# Altium schematic sheet Door_Actuator.SchDoc
size A
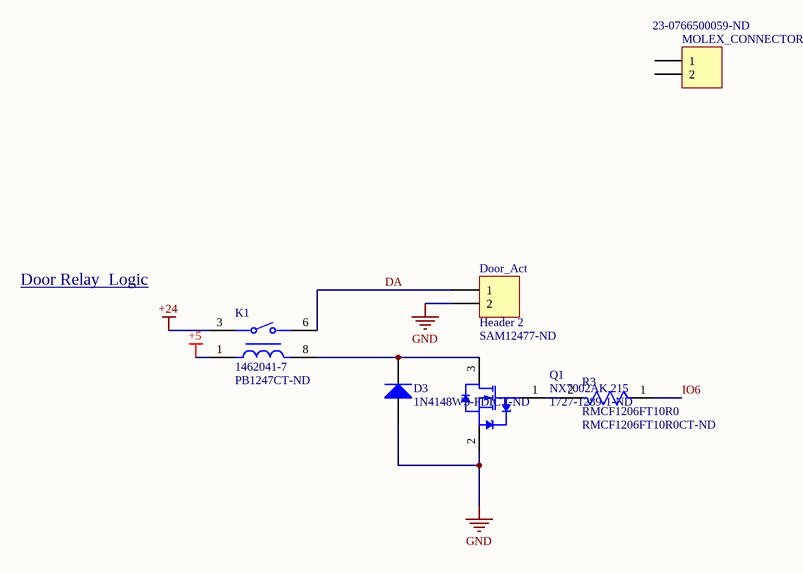
[diagram p0: Door_Actuator.SchDoc]

## Parts
D3  Supplier Part Number 1: 1N4148WS-FDICT-ND  [DIOD-SOD323-2-A_V]  (hidden comment: 1N4148WS-7-F)
Door_Act  Header 2  Supplier Part Number 1: SAM12477-ND  [HDR1X2]
K1  1462041-7  Supplier Part Number 1: PB1247CT-ND  [FP-1462041-7-MFG]
MOLEX_CONNECTOR  Supplier Part Number 1: 23-0766500059-ND  [HDR1X2]  (mechanical)
Q1  NX7002AK,215  Supplier Part Number 1: 1727-1289-1-ND  [NXP-SOT23_L]
R3  RMCF1206FT10R0  Supplier Part Number 1: RMCF1206FT10R0CT-ND  [FP-RMCF1206-IPC_C]

## Nets
+5: K1.1
+24: K1.3
GND: D3.1(A) Door_Act.2 Q1.2(S)
DA: Door_Act.1 K1.6
IO6: R3.1
NetD3_2: D3.2(K) K1.8 Q1.3(D)
NetQ1_1: Q1.1(G) R3.2

Not connected (* = marked no-connect by the designer): MOLEX_CONNECTOR 1 2

## Notes on the sheet
- Door Relay  Logic

## Library data of the parts
D3 = CMP-1667-00004-1: Fast Switching Diode, 75 V, 0.3 A, -65 to 150 degC, 2-Pin SOD323, RoHS, Tape and Reel; Manufacturer: Diodes; Diode Element Material: SILICON; Package Body Material: Plastic; Additional Feature: HIGH RELIABILITY; Diode Type: RECTIFIER; Forward Voltage: 715mV; Non-rep Pk Forward Current-Max: 2A; Number of Elements: 1; Max Output current: 150mA; Max Power Dissipation: 200mW; Rep Pk Reverse Voltage-Max: 75V; Reverse Recovery Time-Max: 0.004us; Time @ Peak Reflow Temperature-Max (s): 30s; Qualification Status: Not Qualified; DatasheetVersion: Rev. 25-2, 03/2016; PackageDescription: 2-Pin Small Outline Diode, Body 1.7 x 1.3 mm; ComponentLink2Description: Datasheet; ComponentLink1URL: http://www.diodes.com/; PackageReference: SOD323-2; ComponentLink2URL: http://www.diodes.com/datasheets/ds30097.pdf; ComponentLink1Description: Manufacturer URL; Supplier 1: Digikey; Manufacturer Part Number: 1N4148WS-7-F; RoHS: Yes; Category: Rectifier Diodes; Stock 1: 593066; Pricing 1: 1=0.1, 10=0.031, 3000=0.0202, 6000=0.017, 9000=0.0161, 15000=0.01599, 21000=0.01592, 30000=0.01585, 75000=0.01569, 150000=0.0156, 300000=0.01551 (USD); Pins: 2; Package Shape: Rectangular; Terminal Finish: Tin; Min Operating Temperature: -65°C; Max Operating Temperature: 150°C; JESD-609 Code: e3; JESD-30 Code: R-PDSO-G2; Moisture Sensitivity Level: 1; Package Style: SMALL OUTLINEMeter; Peak Reflow Temperature (Cel): 260°C; Surface Mount: Yes; Terminal Form: Gull Wing; Terminal Position: DUAL; Reach SVHC Compliant: Yes; RoHS Compliant: Yes; ComponentLink3URL: https://datasheet.ciiva.com:443/pdfs/VipMasterIC/IC/DIOD/DIOD-S-A0001754954/DIOD-S-A0001754954-1.pdf?src-supplier=IHS+Markit; ComponentLink3Description: https://datasheet.ciiva.com:443/pdfs/VipMasterIC/IC/DIOD/DIOD-S-A0001754954/DIOD-S-A0001754954-1.pdf?src-supplier=IHS+Markit; ComponentLink4URL: https://datasheet.ciiva.com/911/ds30097-911742.pdf?src-supplier=Digikey; ComponentLink4Description: https://datasheet.ciiva.com/911/ds30097-911742.pdf?src-supplier=Digikey; ComponentLink5URL: https://datasheet.ciiva.com/911/ds30097-911741.pdf?src-supplier=Digikey; ComponentLink5Description: https://datasheet.ciiva.com/911/ds30097-911741.pdf?src-supplier=Digikey; ComponentLink6URL: https://datasheet.ciiva.com/911/ds30097-911743.pdf?src-supplier=Digikey; ComponentLink6Description: https://datasheet.ciiva.com/911/ds30097-911743.pdf?src-supplier=Digikey; ComponentLink7URL: https://datasheet.ciiva.com/8300/ds30097-8300396.pdf?src-supplier=Avnet; ComponentLink7Description: https://datasheet.ciiva.com/8300/ds30097-8300396.pdf?src-supplier=Avnet; ComponentLink8URL: https://datasheet.ciiva.com/1179/ds30097-1179355.pdf?src-supplier=Element14; ComponentLink8Description: https://datasheet.ciiva.com/1179/ds30097-1179355.pdf?src-supplier=Element14
Door_Act = Header 2: Board Connector, 2 Contact(s), 1 Row(s), Female, Straight, 0.1 inch Pitch, Solder Terminal, Black Insulator, Socket; Manufacturer: Samtec; Manufacturer Part Number: CES-102-01-G-S; Option: General Purpose; Additional Feature: Low Profile; Contact Pattern: RECTANGULAR; Contact Resistance: 10mR; Contact Style: SQ PIN-SKT; Filter Feature: No; Insertion Force-Max: 2.224N; Mating Information: MULTIPLE MATING PARTS AVAILABLE; Number Of Connectors: 1; Polarization Key: POLARIZED HOUSING; Rated Current (Signal): 1A; Number of Contacts: 2; Withdrawl Force-Min: 1.112N; Body Breadth: 0.12inch; Body Depth: 0.2inch; Plating Thickness: 20uin; Reference Standard: UL; Reliability: COMMERCIAL; Supplier 1: Digikey; RoHS: Yes; Category: Connectors; Stock 1: 5771; Pricing 1: 1=0.39, 10=0.329, 100=0.2797, 500=0.24966, 1000=0.23774, 5000=0.21221, 10000=0.20208 (USD); Mounting Technology: Board; Contact Finish - Mating: GOLD (30); Contact Finish - Termination: Gold (Au) - with Nickel (Ni) barrier; Insulation Color: Black; Insulation Material: Glass; Min Operating Temperature: -65°C; Max Operating Temperature: 125°C; Connector Type: BOARD CONNECTOR; JESD-609 Code: e4; Body/Shell Style: SOCKET; Contact Gender: Female; Mixed Contacts: No; Mounting Style: STRAIGHT; Number Of PCB Rows: 1; Number of Rows Loaded: 1; PCB Contact Pattern: RECTANGULAR; Termination: Solder; Body Length: 0.2inch; Mating Contact Pitch: 0.1inch; Terminal Length: 0.12inch; Terminal Pitch: 2.54mm; Flammability Rating: UL94 V-0; DIN Conformance: No; IEC Conformance: No; MIL Conformance: No; Reach SVHC Compliant: Yes; RoHS Compliant: Yes; ComponentLink1URL: https://datasheet.ciiva.com:443/pdfs/VipMasterIC/IC/SAMI/SAMI-S-A0000096262/SAMIS23449-1.pdf?src-supplier=IHS+Markit; ComponentLink1Description: https://datasheet.ciiva.com:443/pdfs/VipMasterIC/IC/SAMI/SAMI-S-A0000096262/SAMIS23449-1.pdf?src-supplier=IHS+Markit; ComponentLink2URL: http://www.farnell.com/datasheets/2045624.pdf?src-supplier=Farnell; ComponentLink2Description: http://www.farnell.com/datasheets/2045624.pdf?src-supplier=Farnell; ComponentLink3URL: http://suddendocs.samtec.com/prints/ces-1xx-xx-x-s-xx-mkt.pdf?src-supplier=Digikey; ComponentLink3Description: http://suddendocs.samtec.com/prints/ces-1xx-xx-x-s-xx-mkt.pdf?src-supplier=Digikey; ComponentLink4URL: http://www.samtec.com/documents/webfiles/pdf/CES.pdf?src-supplier=Avnet; ComponentLink4Description: http://www.samtec.com/documents/webfiles/pdf/CES.pdf?src-supplier=Avnet; ComponentLink5URL: https://datasheet.octopart.com/CES-102-01-G-S-Samtec-datasheet-62107104.pdf?src-supplier=Newark; ComponentLink5Description: https://datasheet.octopart.com/CES-102-01-G-S-Samtec-datasheet-62107104.pdf?src-supplier=Newark; ComponentLink6URL: https://datasheet.octopart.com/CES-102-01-G-S-Samtec-datasheet-130012063.pdf?src-supplier=Toby+Electronics; ComponentLink6Description: https://datasheet.octopart.com/CES-102-01-G-S-Samtec-datasheet-130012063.pdf?src-supplier=Toby+Electronics; ComponentLink7URL: https://datasheet.octopart.com/CES-102-01-G-S-Samtec-datasheet-151455179.pdf?src-supplier=Sager+Electronics; ComponentLink7Description: https://datasheet.octopart.com/CES-102-01-G-S-Samtec-datasheet-151455179.pdf?src-supplier=Sager+Electronics
K1 = CMP-03396-000009-1: RELAY TELECOM SPST 2A 5VDC; Manufacturer: TE Connectivity; Coil Power: 140mW; Standoff Height: 0.25mm; Number Of Contacts: 1; Switching Power: 60W; Coil Type: Non-Latching; Coil Resistance: 178Ω; Coil Voltage: 5V; Throw Configuration: SPST-NO; Coil Current(DC)-Max: 28mA; Coil/Input Supply Type: DC; Contact AC Max Rating R Load: 2A@250VAC; Contact Voltage(AC)-Max: 250V; Contact/Output Supply Type: AC; Relay Action: MOMENTARY; Relay Type: POWER/SIGNAL RELAY; Body Breadth: 6mm; Body Height: 5.71mm; Body Length or Diameter: 10mm; Reference Standard: UL; Sealing: RT5; Manufacturer Part Number: 1462041-7; Package: 1462041-7; Lead Free: Yes; Temperature Range Low: -40°C; Switching Current: 2A; Category: Relay; ComponentLink2Description: Datasheet; Height: 5.65mm; RoHS: TRUE; ComponentLink2URL: https://www.te.com/usa-en/product-1462041-7.html?te_bu=Cor&te_type=other&te_campaign=oct_glo_cor-oct-global-oth-prtnr-fy19-oct-octo-buy-bom_sma-298_2&elqCampaignId=35216; Device Class L1: Electromechanical; Ambient Temperature Range High: +85°C; Temperature Range High: +85°C; Temperature: -40°C to +85°C; Device Class L2: Relays; Device Class L3: Signal Relays; Octopart: https://octopart.com/1462041-7-te+connectivity-42558739; Automotive: No; Ambient Temperature Range Low: -40°C; Digikey Description: RELAY TELECOM SPST 2A 5VDC; Current Rating: 2A; Supplier 1: Digikey; Stock 1: 3163; Pricing 1: 1=5.56, 10=4.956, 25=4.7328, 50=4.5708, 100=4.414, 250=4.21484, 500=4.07006 (USD); Mounting Technology: Surface Mount; Max Operating Temperature: 85°C; Coil Voltage(DC)-Max: 5V; Contact Current(AC)-Max: 2A; Packaging: Tape and Reel; Relay Function: SPST; Termination: Solder; Reach SVHC Compliant: Yes; RoHS Compliant: Yes; ComponentLink1URL: https://datasheet.ciiva.com:443/pdfs/VipMasterIC/IC/TYEL/TYEL-S-A0008743874/TYEL-S-A0008772958-1.pdf?src-supplier=IHS+Markit; ComponentLink1Description: https://datasheet.ciiva.com:443/pdfs/VipMasterIC/IC/TYEL/TYEL-S-A0008743874/TYEL-S-A0008772958-1.pdf?src-supplier=IHS+Markit; ComponentLink3URL: https://datasheet.ciiva.com/46627/eng-cd-1462041-1-a4-1462041-1-46627997.pdf?src-supplier=Digikey; ComponentLink3Description: https://datasheet.ciiva.com/46627/eng-cd-1462041-1-a4-1462041-1-46627997.pdf?src-supplier=Digikey; ComponentLink4URL: https://datasheet.ciiva.com/15185/getdatasheetpartid-294850-15185995.pdf?src-supplier=Verical; ComponentLink4Description: https://datasheet.ciiva.com/15185/getdatasheetpartid-294850-15185995.pdf?src-supplier=Verical
MOLEX_CONNECTOR = Header 2: .093IN Pwr Connector Kit Single Row Panel Mnt Plug & Recept; 4 Ckt; Manufacturer: Molex; Manufacturer Part Number: 76650-0059; Connector Type: BOARD CONNECTOR; Option: General Purpose; Additional Feature: Low Profile; Body/Shell Style: SOCKET; Contact Pattern: RECTANGULAR; Contact Resistance: 10mR; Contact Style: SQ PIN-SKT; Filter Feature: No; Insertion Force-Max: 2.224N; Mating Information: MULTIPLE MATING PARTS AVAILABLE; Number Of Connectors: 1; Polarization Key: POLARIZED HOUSING; Rated Current (Signal): 1A; Number of Contacts: 2; Withdrawl Force-Min: 1.112N; Body Breadth: 0.12inch; Body Depth: 0.2inch; Mating Contact Pitch: 0.1inch; Plating Thickness: 20uin; Reference Standard: UL; Reliability: COMMERCIAL; Category: Connectors; Stock 1: 146; Pricing 1: 1=2.17, 10=1.884 (USD); Mounting Technology: Board; Contact Finish - Mating: GOLD (30); Contact Finish - Termination: Gold (Au) - with Nickel (Ni) barrier; Insulation Color: Black; Insulation Material: Glass; Min Operating Temperature: -65°C; Max Operating Temperature: 125°C; JESD-609 Code: e4; Contact Gender: Female; Mixed Contacts: No; Mounting Style: STRAIGHT; Number Of PCB Rows: 1; Number of Rows Loaded: 1; PCB Contact Pattern: RECTANGULAR; Termination: Solder; Body Length: 0.2inch; Terminal Length: 0.12inch; Terminal Pitch: 2.54mm; Flammability Rating: UL94 V-0; DIN Conformance: No; IEC Conformance: No; MIL Conformance: No; Reach SVHC Compliant: Yes; RoHS Compliant: Yes; Supplier 1: Digikey; RoHS: Yes; ComponentLink1URL: https://datasheet.ciiva.com/2094/76650-0059-2094686.pdf?src-supplier=Digikey; ComponentLink1Description: https://datasheet.ciiva.com/2094/76650-0059-2094686.pdf?src-supplier=Digikey; ComponentLink2URL: https://datasheet.ciiva.com/1090/525462-1090718.pdf?src-supplier=Element14; ComponentLink2Description: https://datasheet.ciiva.com/1090/525462-1090718.pdf?src-supplier=Element14; ComponentLink3URL: https://datasheet.ciiva.com/1090/76650-0059-1090822.pdf?src-supplier=Newark; ComponentLink3Description: https://datasheet.ciiva.com/1090/76650-0059-1090822.pdf?src-supplier=Newark; ComponentLink4URL: https://datasheet.ciiva.com/5170/datasheet2076650-0059-196700-5170205.pdf?src-supplier=Mouser; ComponentLink4Description: https://datasheet.ciiva.com/5170/datasheet2076650-0059-196700-5170205.pdf?src-supplier=Mouser; ComponentLink5URL: https://datasheet.ciiva.com/18451/70191308-18451020.pdf?src-supplier=Allied+Electronics; ComponentLink5Description: https://datasheet.ciiva.com/18451/70191308-18451020.pdf?src-supplier=Allied+Electronics
Q1 = CMP-1258-00137-1: Single N-Channel Trench MOSFET, 60 V, -55 to 150 degC, 3-Pin SOT23, Tape and Reel; Manufacturer: NXP Semiconductors; Packing: Tape & Reel; VGSth [typ] (V): 1.6; Coss [typ] (pF): 3.4; Channel Type: N; Ciss [typ] (pF): 11; VDS [max] (V): 60; Package Body Material: Plastic; Transistor Element Material: SILICON; Drain Current-Max (ID): 190mA; Drain-source On Resistance-Max: 5.2R; DS Breakdown Voltage-Min: 60V; FET Technology: METAL-OXIDE SEMICONDUCTOR; Number of Elements: 1; Operating Mode: ENHANCEMENT MODE; Transistor Application: SWITCHING; Reference Standard: IEC-60134; JEDEC-95 Code: TO-236AB; ComponentLink2Description: Datasheet; PackageDescription: 3-Pin Small Outline Transistor Package, Body 2.9 x 1.3 mm, Pitch 0.95 mm; Mounting Technology: Surface Mount; PackageVersion: 06-03-16, 03/2006; Code_JEDEC: TO-236AB; ComponentLink3Description: Package Specification; DatasheetVersion: Rev. 5; ComponentLink2URL: http://www.nxp.com/documents/data_sheet/NX7002AK.pdf; ComponentLink1URL: http://www.nxp.com/; ComponentLink1Description: Manufacturer URL; PackageReference: SOT23; PartNumber: NX7002AK,215; ComponentLink3URL: http://www.nxp.com/documents/outline_drawing/sot023_po.pdf; Supplier 1: Digikey; Manufacturer Part Number: NX7002AK,215; RoHS: Yes; Category: MOSFETs; Stock 1: 306595; Pricing 1: 1=0.13, 10=0.088, 100=0.0428, 500=0.04112, 1000=0.0363 (USD); Pins: 3; Package Shape: Rectangular; Terminal Finish: Tin; JESD-609 Code: e3; Polarity/Channel Type: N-CHANNEL; JESD-30 Code: R-PDSO-G3; Moisture Sensitivity Level: 1; Package Style: SMALL OUTLINEMeter; Surface Mount: Yes; Terminal Form: Gull Wing; Terminal Position: DUAL; Reach SVHC Compliant: Yes; RoHS Compliant: Yes; ComponentLink4URL: https://datasheet.ciiva.com:443/pdfs/VipMasterIC/IC/PHGL/PHGLS26009/PHGLS26012-1.pdf?src-supplier=IHS+Markit; ComponentLink4Description: https://datasheet.ciiva.com:443/pdfs/VipMasterIC/IC/PHGL/PHGLS26009/PHGLS26012-1.pdf?src-supplier=IHS+Markit; ComponentLink5URL: http://www.farnell.com/datasheets/1968065.pdf?src-supplier=Farnell; ComponentLink5Description: http://www.farnell.com/datasheets/1968065.pdf?src-supplier=Farnell; ComponentLink6URL: http://www.farnell.com/datasheets/1968065.pdf?src-supplier=Newark; ComponentLink6Description: http://www.farnell.com/datasheets/1968065.pdf?src-supplier=Newark
R3 = CMP-26527-000112-1: RES 10 OHM 1% 1/4W 1206; Manufacturer: Stackpole Electronics; Temperature Coefficient: 100ppm/°C; Resistance: 10R; Working Voltage: 200V; Max Power Dissipation: 250mW; Rated Temperature: 70°C; Value: 10R; Temperature Coefficient (ppm/Cel): 100; Package Height: 0.55mm; Package Length: 3.2mm; Package Width: 1.6mm; Reference Standard: AEC-Q200; Width: 0.063inch; Case/Package: 1206; Series: RMCF; Number of Terminations: 2; Case Code (Imperial): 1206; Contact Plating: Tin; Packaging: Tape and Reel; Lead Free: Lead Free; Depth: 1.6mm; Case Code (Metric): 3216; RoHS Compliant: Yes; Height: 0.028inch; Resistor Type: Thick Film; Tolerance: 1%; Military Standard: Not; Radiation Hardening: No; Mount: Surface Mount; Length: 3.2mm; Power Rating: 250mW; Min Operating Temperature: -55°C; Features: Automotive AEC-Q200; Construction: Rectangular; Max Operating Temperature: 155°C; Supplier 1: Digikey; Manufacturer Part Number: RMCF1206FT10R0; RoHS: Yes; Category: Chip SMD Resistors; Stock 1: 402347; Pricing 1: 1=0.1, 10=0.029, 100=0.0144, 1000=0.00806, 2500=0.00702 (USD); Mounting Technology: Surface Mount; Pins: 2; Package Shape: Rectangular; Terminal Finish: Nickel; JESD-609 Code: e3; Power: 250mW; Technology: METAL GLAZE/THICK FILM; Termination: Wraparound; Reach SVHC Compliant: Yes; ComponentLink1URL: https://datasheet.ciiva.com:443/pdfs/VipMasterIC/IC/SEIE/SEIE-S-A0009541969/SEIE-S-A0009541969-1.pdf?src-supplier=IHS+Markit; ComponentLink1Description: https://datasheet.ciiva.com:443/pdfs/VipMasterIC/IC/SEIE/SEIE-S-A0009541969/SEIE-S-A0009541969-1.pdf?src-supplier=IHS+Markit; ComponentLink2URL: https://datasheet.ciiva.com/15193/getdatasheetpartid-408274-15193660.pdf?src-supplier=Verical; ComponentLink2Description: https://datasheet.ciiva.com/15193/getdatasheetpartid-408274-15193660.pdf?src-supplier=Verical